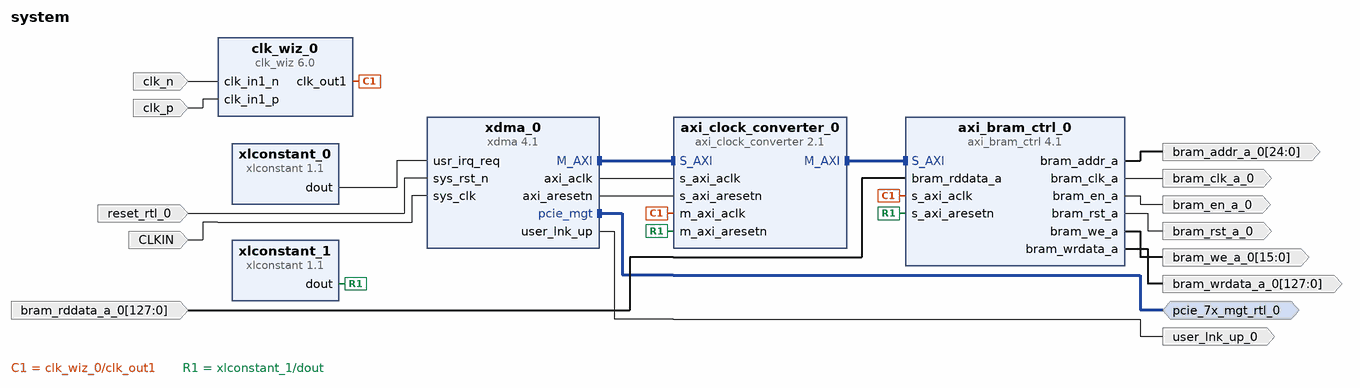
[diagram p0: block diagram of the top level]
# Vivado block design system, xc7vx690tffg1761-2, Vivado 2018.3
create_bd_design system

create_bd_intf_port -mode Master -vlnv xilinx.com:interface:pcie_7x_mgt_rtl:1.0 pcie_7x_mgt_rtl_0
create_bd_port -dir I -type rst reset_rtl_0
set_property -dict {CONFIG.POLARITY ACTIVE_LOW} [get_bd_ports reset_rtl_0]
create_bd_port -dir O user_lnk_up_0
create_bd_port -dir I -type clk CLKIN
set_property -dict {CONFIG.FREQ_HZ 100000000} [get_bd_ports CLKIN]
create_bd_port -dir I clk_p
create_bd_port -dir I clk_n
create_bd_port -dir O -from 24 -to 0 bram_addr_a_0
create_bd_port -dir O -type clk bram_clk_a_0
create_bd_port -dir O -from 127 -to 0 bram_wrdata_a_0
create_bd_port -dir I -from 127 -to 0 bram_rddata_a_0
create_bd_port -dir O bram_en_a_0
create_bd_port -dir O -type rst bram_rst_a_0
create_bd_port -dir O -from 15 -to 0 bram_we_a_0

create_bd_cell -type ip -vlnv xilinx.com:ip:xdma:4.1 xdma_0
set_property -dict [list \
  CONFIG.PF0_DEVICE_ID_mqdma 9024 \
  CONFIG.PF2_DEVICE_ID_mqdma 9024 \
  CONFIG.PF3_DEVICE_ID_mqdma 9024 \
  CONFIG.axi_data_width 128_bit \
  CONFIG.axilite_master_en false \
  CONFIG.axist_bypass_en true \
  CONFIG.axisten_freq 125 \
  CONFIG.cfg_mgmt_if false \
  CONFIG.mode_selection Basic \
  CONFIG.pcie_blk_locn X0Y1 \
  CONFIG.pcie_extended_tag false \
  CONFIG.pf0_Use_Class_Code_Lookup_Assistant false \
  CONFIG.pf0_class_code_base 05 \
  CONFIG.pf0_class_code_interface 00 \
  CONFIG.pf0_class_code_sub 80 \
  CONFIG.pf0_device_id 7024 \
  CONFIG.pf0_interrupt_pin NONE \
  CONFIG.pf0_msi_enabled false \
  CONFIG.pf0_msix_cap_pba_bir BAR_0 \
  CONFIG.pf0_msix_cap_pba_offset 00008FE0 \
  CONFIG.pf0_msix_cap_table_bir BAR_0 \
  CONFIG.pf0_msix_cap_table_offset 00008000 \
  CONFIG.pf0_msix_cap_table_size 01F \
  CONFIG.pf0_msix_enabled true \
  CONFIG.pf0_sub_class_interface_menu Generic_XT_compatible_serial_controller \
  CONFIG.pl_link_cap_max_link_speed 5.0_GT/s \
  CONFIG.pl_link_cap_max_link_width X4 \
  CONFIG.plltype QPLL1 \
  CONFIG.ref_clk_freq 100_MHz \
  CONFIG.xdma_axi_intf_mm AXI_Memory_Mapped \
  CONFIG.xdma_num_usr_irq 16 \
  CONFIG.xdma_pcie_64bit_en false \
  CONFIG.xdma_rnum_chnl 4 \
  CONFIG.xdma_wnum_chnl 4 \
] [get_bd_cells xdma_0]
create_bd_cell -type ip -vlnv xilinx.com:ip:axi_bram_ctrl:4.1 axi_bram_ctrl_0
set_property -dict [list \
  CONFIG.DATA_WIDTH 128 \
  CONFIG.PROTOCOL AXI4 \
  CONFIG.READ_LATENCY 6 \
  CONFIG.SINGLE_PORT_BRAM 1 \
  CONFIG.USE_ECC 0 \
] [get_bd_cells axi_bram_ctrl_0]
create_bd_cell -type ip -vlnv xilinx.com:ip:xlconstant:1.1 xlconstant_0
set_property -dict {CONFIG.CONST_VAL 0 CONFIG.CONST_WIDTH 16} [get_bd_cells xlconstant_0]
create_bd_cell -type ip -vlnv xilinx.com:ip:axi_clock_converter:2.1 axi_clock_converter_0
create_bd_cell -type ip -vlnv xilinx.com:ip:xlconstant:1.1 xlconstant_1
create_bd_cell -type ip -vlnv xilinx.com:ip:clk_wiz:6.0 clk_wiz_0
set_property -dict [list \
  CONFIG.CLKIN1_JITTER_PS 50.0 \
  CONFIG.CLKOUT1_JITTER 142.473 \
  CONFIG.CLKOUT1_PHASE_ERROR 157.402 \
  CONFIG.CLKOUT1_REQUESTED_OUT_FREQ 150 \
  CONFIG.MMCM_CLKFBOUT_MULT_F 19.875 \
  CONFIG.MMCM_CLKIN1_PERIOD 5.000 \
  CONFIG.MMCM_CLKIN2_PERIOD 10.0 \
  CONFIG.MMCM_CLKOUT0_DIVIDE_F 6.625 \
  CONFIG.MMCM_DIVCLK_DIVIDE 4 \
  CONFIG.PRIM_IN_FREQ 200.000 \
  CONFIG.PRIM_SOURCE Differential_clock_capable_pin \
  CONFIG.USE_LOCKED false \
  CONFIG.USE_RESET false \
] [get_bd_cells clk_wiz_0]

# ---- connections ----

connect_bd_intf_net [get_bd_intf_pins xdma_0/M_AXI] [get_bd_intf_pins axi_clock_converter_0/S_AXI]
connect_bd_intf_net [get_bd_intf_ports pcie_7x_mgt_rtl_0] [get_bd_intf_pins xdma_0/pcie_mgt]
connect_bd_intf_net [get_bd_intf_pins axi_clock_converter_0/M_AXI] [get_bd_intf_pins axi_bram_ctrl_0/S_AXI]
connect_bd_net -net reset_rtl_0_1 [get_bd_ports reset_rtl_0] [get_bd_pins xdma_0/sys_rst_n]
connect_bd_net [get_bd_pins xdma_0/user_lnk_up] [get_bd_ports user_lnk_up_0]
connect_bd_net [get_bd_ports CLKIN] [get_bd_pins xdma_0/sys_clk]
connect_bd_net [get_bd_pins xlconstant_0/dout] [get_bd_pins xdma_0/usr_irq_req]
connect_bd_net [get_bd_pins xdma_0/axi_aclk] [get_bd_pins axi_clock_converter_0/s_axi_aclk]
connect_bd_net [get_bd_pins xdma_0/axi_aresetn] [get_bd_pins axi_clock_converter_0/s_axi_aresetn]
connect_bd_net [get_bd_pins clk_wiz_0/clk_out1] [get_bd_pins axi_bram_ctrl_0/s_axi_aclk] [get_bd_pins axi_clock_converter_0/m_axi_aclk]
connect_bd_net [get_bd_pins xlconstant_1/dout] [get_bd_pins axi_bram_ctrl_0/s_axi_aresetn] [get_bd_pins axi_clock_converter_0/m_axi_aresetn]
connect_bd_net [get_bd_ports clk_n] [get_bd_pins clk_wiz_0/clk_in1_n]
connect_bd_net [get_bd_ports clk_p] [get_bd_pins clk_wiz_0/clk_in1_p]
connect_bd_net [get_bd_pins axi_bram_ctrl_0/bram_addr_a] [get_bd_ports bram_addr_a_0]
connect_bd_net [get_bd_pins axi_bram_ctrl_0/bram_clk_a] [get_bd_ports bram_clk_a_0]
connect_bd_net [get_bd_pins axi_bram_ctrl_0/bram_wrdata_a] [get_bd_ports bram_wrdata_a_0]
connect_bd_net -net bram_rddata_a_0_1 [get_bd_ports bram_rddata_a_0] [get_bd_pins axi_bram_ctrl_0/bram_rddata_a]
connect_bd_net [get_bd_pins axi_bram_ctrl_0/bram_en_a] [get_bd_ports bram_en_a_0]
connect_bd_net [get_bd_pins axi_bram_ctrl_0/bram_rst_a] [get_bd_ports bram_rst_a_0]
connect_bd_net [get_bd_pins axi_bram_ctrl_0/bram_we_a] [get_bd_ports bram_we_a_0]

# ---- address map ----
assign_bd_address -offset 0x0000000000000000 -range 32M -target_address_space [get_bd_addr_spaces xdma_0/M_AXI] [get_bd_addr_segs axi_bram_ctrl_0/S_AXI/Mem0]

validate_bd_design
save_bd_design
